# EAGLE board DE0EC8A (EAGLE 5.10), part 1 of 2
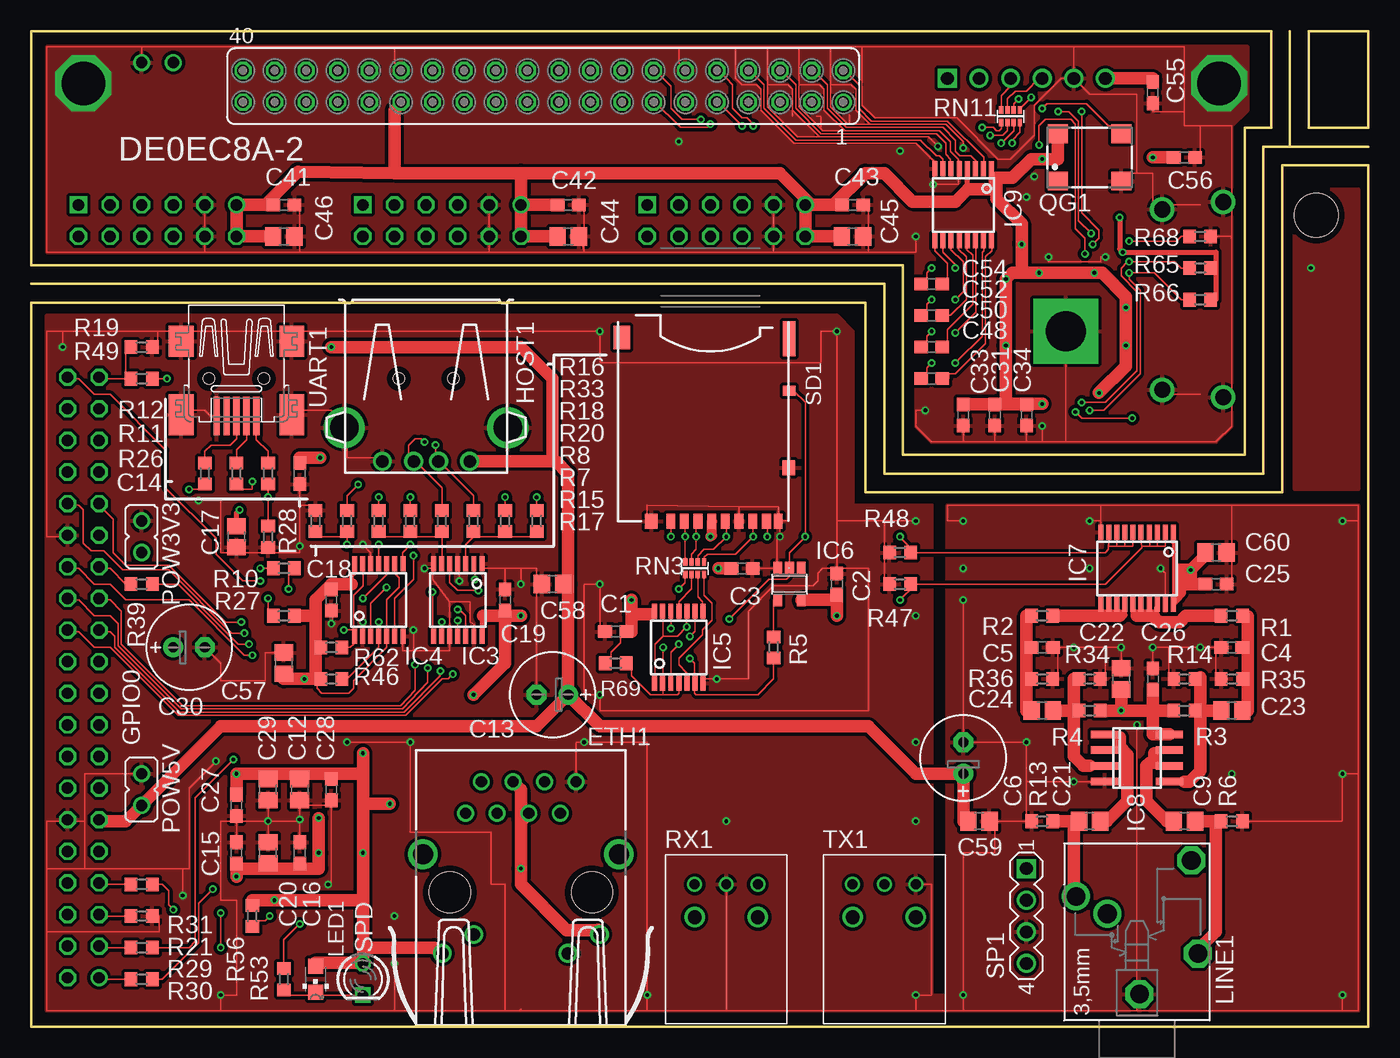
[diagram p2: board, top side]
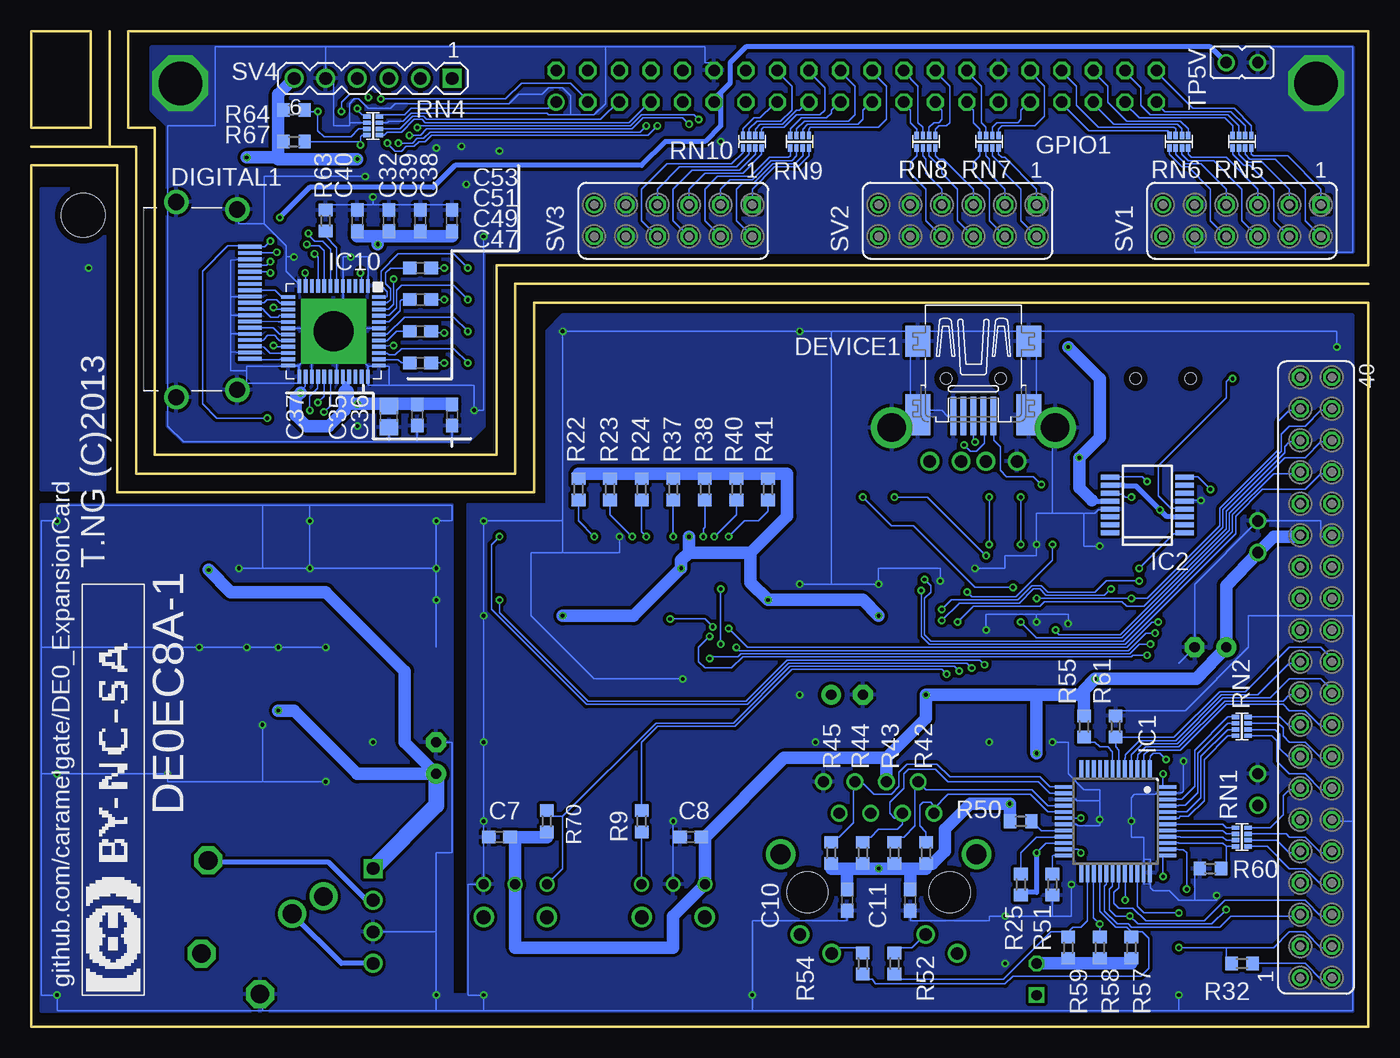
[diagram p3: board, bottom side, seen from below]

Size 107.5 x 80 mm. Coordinates in mm from the lower left corner, seen from the top.
Outline: 0,59.69 68.58,59.69 68.58,44.45 99.06,44.45 99.06,70.72 101.2,70.72
Outline: 101.2,70.72 101.2,80
Outline: 107.5,70.72 101.2,70.72
Outline: 0,0 107.5,0 107.5,69.22 100.56,69.22 100.56,42.95 67.08,42.95 67.08,58.19 0,58.19 0,0
Outline: 0,80 0,61.19 70.08,61.19 70.08,45.95 97.56,45.95 97.56,72.22 99.7,72.22 99.7,80 0,80
Outline: 107.5,80 102.7,80 102.7,72.22 107.5,72.22 107.5,80
Copper layers (1*16): Top 0.035mm / dielectric 1.53mm / Bottom 0.035mm
Design rules "pban_5mil-l2": minimum track width 5mil, minimum drill 0.3mm, track to track 5mil, track to pad 0.229mm, pad to pad 5mil, via to via 5mil, smd to smd 5mil, copper to edge 0.5mm, drill to drill 0.5mm, minimum pad ring 0.15mm, minimum via ring 0.15mm, stop-mask expansion 4mil, vias tented up to drill 0.35mm, thermal gap 10mil
Holes 3.5 mm at 103.3,65.2

## Footprints (pad centres in the part's own frame; a part is rotated, then mirrored left to right if it is on the bottom)
C1608 = smd 1.1 x 1: 1 -0.85,0; 2 0.85,0
E2,5-7 = drill 0.813 pad 1.6 round: + -1.27,0 | drill 0.813 pad 1.6 octagon: - 1.27,0
C2012 = smd 1.3 x 1.5: 1 -0.85,0; 2 0.85,0
32005-201 = smd 3.1 x 0.5: 1 3,1.6; 2 3,0.8; 3 3,0; 4 3,-0.8; 5 3,-1.6 | smd 2.5 x 2: M1 -3,-4.45; M2 -3,4.45 | smd 3.3 x 2: M3 2.9,4.45; M4 2.9,-4.45 | hole 0.9: 0,2.2; 0,-2.2
HDMI-FCI-A-UPDATE = smd 0.3 x 1.9: 1 4.75,8.5; 2 4.25,8.5; 3 3.75,8.5; 4 3.25,8.5; 5 2.75,8.5; 6 2.25,8.5; 7 1.75,8.5; 8 1.25,8.5; 9 0.75,8.5; 10 0.25,8.5; 11 -0.25,8.5; 12 -0.75,8.5; 13 -1.25,8.5; 14 -1.75,8.5; 15 -2.25,8.5; 16 -2.75,8.5; 17 -3.25,8.5; 18 -3.75,8.5; 19 -4.25,8.5 | drill 1.3 round: 20 -7.85,2.6; 21 7.85,2.6; 22 -7.25,7.5; 23 7.25,7.5
J0B = drill 0.9 pad 1.3 round: 1 -4.445,-1.27; 2 -3.175,1.27; 3 -1.905,-1.27; 4 -0.635,1.27; 5 0.635,-1.27; 6 1.905,1.27; 7 3.175,-1.27; 8 4.445,1.27 | drill 1 pad 1.422 round: 9 -6.325,-12.52; 10 -3.785,-11; 11 3.785,-12.52; 12 6.325,-11 | drill 1.6 pad 2.184 round: M1 -7.875,-4.57; M2 7.875,-4.57 | hole 3.3: 5.715,-7.62; -5.715,-7.62
FE20-2 = drill 0.914 round: 1 -24.13,1.27 | drill 0.914 octagon: 2 -24.13,-1.27; 3 -21.59,1.27; 4 -21.59,-1.27; 5 -19.05,1.27; 6 -19.05,-1.27; 7 -16.51,1.27; 8 -16.51,-1.27; 9 -13.97,1.27; 10 -13.97,-1.27; 11 -11.43,1.27; 12 -11.43,-1.27; 13 -8.89,1.27; 14 -8.89,-1.27; 15 -6.35,1.27; 16 -6.35,-1.27; 17 -3.81,1.27; 18 -3.81,-1.27; 19 -1.27,1.27; 20 -1.27,-1.27; 21 1.27,1.27; 22 1.27,-1.27; 23 3.81,1.27; 24 3.81,-1.27; 25 6.35,1.27; 26 6.35,-1.27; 27 8.89,1.27; 28 8.89,-1.27; 29 11.43,1.27; 30 11.43,-1.27; 31 13.97,1.27; 32 13.97,-1.27; 33 16.51,1.27; 34 16.51,-1.27; 35 19.05,1.27; 36 19.05,-1.27; 37 21.59,1.27; 38 21.59,-1.27; 39 24.13,1.27; 40 24.13,-1.27
USB-A = drill 1 round: 1 -3.5,12.99; 2 -1,12.99; 3 1,12.99; 4 3.5,12.99 | drill 2.3 round: P$1 -6.57,10.28; P$2 6.57,10.28
LQFP48 = smd 1.5 x 0.3: 1 -4.15,2.75; 2 -4.15,2.25; 3 -4.15,1.75; 4 -4.15,1.25; 5 -4.15,0.75; 6 -4.15,0.25; 7 -4.15,-0.25; 8 -4.15,-0.75; 9 -4.15,-1.25; 10 -4.15,-1.75; 11 -4.15,-2.25; 12 -4.15,-2.75; 25 4.15,-2.75; 26 4.15,-2.25; 27 4.15,-1.75; 28 4.15,-1.25; 29 4.15,-0.75; 30 4.15,-0.25; 31 4.15,0.25; 32 4.15,0.75; 33 4.15,1.25; 34 4.15,1.75; 35 4.15,2.25; 36 4.15,2.75 | smd 0.3 x 1.5: 13 -2.75,-4.15; 14 -2.25,-4.15; 15 -1.75,-4.15; 16 -1.25,-4.15; 17 -0.75,-4.15; 18 -0.25,-4.15; 19 0.25,-4.15; 20 0.75,-4.15; 21 1.25,-4.15; 22 1.75,-4.15; 23 2.25,-4.15; 24 2.75,-4.15; 37 2.75,4.15; 38 2.25,4.15; 39 1.75,4.15; 40 1.25,4.15; 41 0.75,4.15; 42 0.25,4.15; 43 -0.25,4.15; 44 -0.75,4.15; 45 -1.25,4.15; 46 -1.75,4.15; 47 -2.25,4.15; 48 -2.75,4.15
FT230X = smd 0.4 x 1.5: 1 -2.223,-2.99; 2 -1.587,-2.99; 3 -0.953,-2.99; 4 -0.318,-2.99; 5 0.318,-2.99; 6 0.953,-2.99; 7 1.587,-2.99; 8 2.223,-2.99; 9 2.223,2.99; 10 1.587,2.99; 11 0.953,2.99; 12 0.318,2.99; 13 -0.318,2.99; 14 -0.953,2.99; 15 -1.587,2.99; 16 -2.223,2.99
PW_R-PDSO-G14 = smd 0.4 x 1.2: 1 -1.95,-2.9; 2 -1.3,-2.9; 3 -0.65,-2.9; 4 0,-2.9; 5 0.65,-2.9; 6 1.3,-2.9; 7 1.95,-2.9; 8 1.95,2.9; 9 1.3,2.9; 10 0.65,2.9; 11 0,2.9; 12 -0.65,2.9; 13 -1.3,2.9; 14 -1.95,2.9
SOT23-5 = smd 0.69 x 0.99: 1 -0.95,-1.29; 2 0,-1.29; 3 0.95,-1.29; 4 0.95,1.3; 5 -0.95,1.3
PW_R-PDSO-G20 = smd 0.4 x 1.2: 1 -2.925,-2.9; 2 -2.275,-2.9; 3 -1.625,-2.9; 4 -0.975,-2.9; 5 -0.325,-2.9; 6 0.325,-2.9; 7 0.975,-2.9; 8 1.625,-2.9; 9 2.275,-2.9; 10 2.925,-2.9; 11 2.925,2.9; 12 2.275,2.9; 13 1.625,2.9; 14 0.975,2.9; 15 0.325,2.9; 16 -0.325,2.9; 17 -0.975,2.9; 18 -1.625,2.9; 19 -2.275,2.9; 20 -2.925,2.9
SO08 = smd 0.6 x 2.2: 1 -1.905,-2.6; 2 -0.635,-2.6; 3 0.635,-2.6; 4 1.905,-2.6; 5 1.905,2.6; 6 0.635,2.6; 7 -0.635,2.6; 8 -1.905,2.6
PW_R-PDSO-G16 = smd 0.4 x 1.2: 1 -2.275,-2.9; 2 -1.625,-2.9; 3 -0.975,-2.9; 4 -0.325,-2.9; 5 0.325,-2.9; 6 0.975,-2.9; 7 1.625,-2.9; 8 2.275,-2.9; 9 2.275,2.9; 10 1.625,2.9; 11 0.975,2.9; 12 0.325,2.9; 13 -0.325,2.9; 14 -0.975,2.9; 15 -1.625,2.9; 16 -2.275,2.9
QFN48-A3 = smd 1.1 x 0.3: 1 -3.65,2.75; 2 -3.65,2.25; 3 -3.65,1.75; 4 -3.65,1.25; 5 -3.65,0.75; 6 -3.65,0.25; 7 -3.65,-0.25; 8 -3.65,-0.75; 9 -3.65,-1.25; 10 -3.65,-1.75; 11 -3.65,-2.25; 12 -3.65,-2.75; 25 3.65,-2.75; 26 3.65,-2.25; 27 3.65,-1.75; 28 3.65,-1.25; 29 3.65,-0.75; 30 3.65,-0.25; 31 3.65,0.25; 32 3.65,0.75; 33 3.65,1.25; 34 3.65,1.75; 35 3.65,2.25; 36 3.65,2.75 | smd 0.3 x 1.1: 13 -2.75,-3.65; 14 -2.25,-3.65; 15 -1.75,-3.65; 16 -1.25,-3.65; 17 -0.75,-3.65; 18 -0.25,-3.65; 19 0.25,-3.65; 20 0.75,-3.65; 21 1.25,-3.65; 22 1.75,-3.65; 23 2.25,-3.65; 24 2.75,-3.65; 37 2.75,3.65; 38 2.25,3.65; 39 1.75,3.65; 40 1.25,3.65; 41 0.75,3.65; 42 0.25,3.65; 43 -0.25,3.65; 44 -0.75,3.65; 45 -1.25,3.65; 46 -1.75,3.65; 47 -2.25,3.65; 48 -2.75,3.65 | drill 3.2 pad 5.2 square: EXP 0,0
LSR976 = smd 1.2 x 1.2: A 0,-1.05; C 0,1.05
PG203JA = drill 1.499 octagon: 1 -5.004,-0.203; 4 5.74,-4.369; 5 -1.753,-4.902 | drill 1.499 round: 2 2.845,4.902; 3 1.448,2.388
JP1A = drill 0.914 round: 1 0,-1.27; 2 0,1.27
SM77H = smd 1.6 x 1.5: 1 -2.55,-1.9; 2 2.55,-1.9; 3 2.55,1.9; 4 -2.55,1.9
R0603 = smd 1 x 1.1: 1 -0.85,0; 2 0.85,0
EXB28V = smd 0.35 x 0.6: 1 -0.75,-0.5; 2 -0.25,-0.5; 3 0.25,-0.5; 4 0.75,-0.5; 5 0.75,0.5; 6 0.25,0.5; 7 -0.25,0.5; 8 -0.75,0.5
PL_13X/T10 = drill 0.8 round: 1 2.54,0; 2 0,0; 3 -2.54,0 | drill 1.1 round: 4 2.54,2.63; 5 -2.54,2.63
DM3A-SF-PEJ-A = smd 0.7 x 1.2: 1 3.2,16.55; 2 2.1,16.55; 3 1,16.55; 4 -0.1,16.55; 5 -1.2,16.55; 6 -2.3,16.55; 7 -3.4,16.55; 8 -4.5,16.55; CD1 -5.45,16.55 | smd 1 x 0.8: CD2 -6.325,6.05 | smd 1 x 1.2: GND1 4.75,16.55; GND2 -6.3,12.25 | smd 1 x 2.8: GND3 -6.325,1.875 | smd 1.3 x 1.9: GND4 7.125,1.775
MA04-1A = drill 1.016 square: 1 -3.81,0 | drill 1.016 round: 2 -1.27,0; 3 1.27,0; 4 3.81,0
LED3MM = drill 0.813 octagon: A -1.27,0 | drill 0.813 square: K 1.27,0
FE06-2P = drill 0.914 square: 1 6.35,1.27 | drill 0.914 octagon: 2 6.35,-1.27; 3 3.81,1.27; 4 3.81,-1.27; 5 1.27,1.27; 6 1.27,-1.27; 7 -1.27,1.27; 8 -1.27,-1.27; 9 -3.81,1.27; 10 -3.81,-1.27; 12 -6.35,-1.27 | drill 0.914 round: 11 -6.35,1.27
MA06-1A = drill 1.016 square: 1 -6.35,0 | drill 1.016 round: 2 -3.81,0; 3 -1.27,0; 4 1.27,0; 5 3.81,0; 6 6.35,0

## Placement (x,y rotation side)
C1  0.1u  [C1608]  46.99,31.75 0 top
C2  0.1u  [C1608]  64.77,35.56 270 top
C3  0.1u  [C1608]  57.15,36.83 180 top
C4  220p  [C1608]  96.52,30.48 180 top
C5  220p  [C1608]  81.28,30.48 0 top
C6  47uF  [E2,5-7]  74.93,21.59 90 top
C7  0.1u  [C1608]  69.85,15.24 0 bottom
C8  0.1u  [C1608]  54.48,15.24 0 bottom
C9  10u  [C2012]  92.71,16.51 0 top
C10  0.1u  [C1608]  41.91,10.16 270 bottom
C11  0.1u  [C1608]  36.83,10.16 270 bottom
C12  10u  [C2012]  21.59,19.05 270 top
C13  47uF  [E2,5-7]  41.91,26.67 180 top
C14  0.1u  [C1608]  21.59,44.45 90 top
C15  0.1u  [C1608]  16.51,13.97 90 top
C16  0.1u  [C1608]  21.59,13.97 90 top
C17  10u  [C2012]  16.51,39.37 90 top
C18  0.1u  [C1608]  24.13,34.29 90 top
C19  0.1u  [C1608]  38.1,34.29 270 top
C20  10u  [C2012]  19.05,13.97 90 top
C21  10u  [C2012]  85.09,16.51 180 top
C22  10u  [C2012]  87.63,27.94 90 top
C23  10u  [C2012]  96.52,25.4 180 top
C24  10u  [C2012]  81.28,25.4 0 top
C25  0.1u  [C1608]  95.25,35.56 180 top
C26  0.1u  [C1608]  90.17,27.94 270 top
C27  0.1u  [C1608]  16.51,17.78 270 top
C28  0.1u  [C1608]  24.13,19.05 270 top
C29  10u  [C2012]  19.05,19.05 270 top
C30  47uF  [E2,5-7]  12.7,30.48 0 top
C31  0.1uF  [C1608]  77.47,49.15 270 top
C32  0.1uF  [C1608]  78.74,64.77 90 bottom
C33  0.1uF  [C1608]  74.93,49.15 270 top
C34  0.1uF  [C1608]  80.01,49.15 270 top
C35  0.1uF  [C1608]  76.45,49.15 270 bottom
C36  0.1uF  [C1608]  73.66,49.15 270 bottom
C37  10u  [C2012]  78.74,49.02 270 bottom
C38  0.1uF  [C1608]  73.66,64.77 90 bottom
C39  0.1uF  [C1608]  76.2,64.77 90 bottom
C40  0.1uF  [C1608]  81.28,64.77 90 bottom
C41  0.1uF  [C1608]  20.32,66.04 180 top
C42  0.1uF  [C1608]  43.18,66.04 180 top
C43  0.1uF  [C1608]  66.04,66.04 180 top
C44  10u  [C2012]  43.18,63.5 180 top
C45  10u  [C2012]  66.04,63.5 180 top
C46  10u  [C2012]  20.32,63.5 180 top
C47  0.1uF  [C1608]  76.2,53.34 180 bottom
C48  0.1uF  [C1608]  72.39,52.07 180 top
C49  0.1uF  [C1608]  76.2,55.88 180 bottom
C50  0.1uF  [C1608]  72.39,54.61 180 top
C51  0.1uF  [C1608]  76.2,58.42 180 bottom
C52  0.1uF  [C1608]  72.39,57.15 180 top
C53  0.1uF  [C1608]  76.2,60.96 180 bottom
C54  0.1uF  [C1608]  72.39,59.69 180 top
C55  0.1uF  [C1608]  90.17,75.06 90 top
C56  0.1uF  [C1608]  92.71,69.85 0 top
C57  10u  [C2012]  20.32,29.21 90 top
C58  10u  [C2012]  41.91,35.56 180 top
C59  10u  [C2012]  76.2,16.51 0 top
C60  10u  [C2012]  95.25,38.1 0 top
DEVICE1  MINI-USB-SCHIELD-32005-201  [32005-201]  31.75,52.07 270 bottom
DIGITAL1  [HDMI-FCI-A-UPDATE]  98.42,58.42 270 bottom
ETH1  J0011D21BNL  [J0B]  39.37,18.41 0 top
GPIO0  [FE20-2]  4.2,28.06 90 bottom
GPIO1  [FE20-2]  41.16,75.56 180 top
HOST1  [USB-A]  31.75,58.42 180 top
IC1  DP83848C  [LQFP48]  20.32,16.51 270 bottom
IC2  FT230X  [FT230X]  17.78,41.91 90 bottom
IC3  74CBTLV3125TSSOP  [PW_R-PDSO-G14]  34.29,34.29 180 top
IC4  74VHC125TSSOP  [PW_R-PDSO-G14]  27.94,34.29 0 top
IC5  74VHC125TSSOP  [PW_R-PDSO-G14]  52.07,30.48 0 top
IC6  74LVC1G04DBV  [SOT23-5]  60.96,35.56 180 top
IC7  74VHCT245TSSOP  [PW_R-PDSO-G20]  88.9,36.83 180 top
IC8  LM358D  [SO08]  88.9,21.59 270 top
IC9  FIN1047  [PW_R-PDSO-G16]  74.93,66.04 180 top
IC10  PTN3360DA3  [QFN48-A3]  83.19,55.88 270 bottom
LED1  LSR976  [LSR976]  22.86,3.81 180 top
LINE1  AJ1780  [PG203JA]  88.9,7.62 90 top
POW3V3  [JP1A]  8.89,39.37 180 top
POW5V  [JP1A]  8.89,19.05 180 top
QG1  27MHz  [SM77H]  85.09,69.85 0 top
R1  2.2k  [R0603]  96.52,33.02 0 top
R2  2.2k  [R0603]  81.28,33.02 180 top
R3  100k  [R0603]  92.71,25.4 180 top
R4  100k  [R0603]  85.09,25.4 0 top
R5  10k  [R0603]  59.69,30.48 270 top
R6  56k  [R0603]  96.52,16.51 0 top
R7  22  [R0603]  35.56,40.64 90 top
R8  22  [R0603]  33.02,40.64 90 top
R9  100  [R0603]  58.42,16.51 270 bottom
R10  100  [R0603]  20.32,36.83 180 top
R11  22  [R0603]  16.51,44.45 90 top
R12  22  [R0603]  13.97,44.45 90 top
R13  56k  [R0603]  81.28,16.51 180 top
R14  100k  [R0603]  92.71,27.94 0 top
R15  1.5k  [R0603]  38.1,40.64 90 top
R16  10k  [R0603]  22.86,40.64 270 top
R17  15k  [R0603]  40.64,40.64 270 top
R18  15k  [R0603]  27.94,40.64 270 top
R19  10k  [R0603]  8.89,54.61 180 top
R20  1.5k  [R0603]  30.48,40.64 90 top
R21  10k  [R0603]  8.89,8.89 180 top
R22  10k  [R0603]  63.5,43.18 90 bottom
R23  10k  [R0603]  60.96,43.18 90 bottom
R24  10k  [R0603]  58.42,43.18 90 bottom
R25  2.2k  [R0603]  27.94,11.43 270 bottom
R26  4.7k(4.87k)  [R0603]  19.05,44.45 90 top
R27  10k  [R0603]  20.32,33.02 180 top
R28  10k  [R0603]  19.05,39.37 90 top
R29  100  [R0603]  8.89,6.35 0 top
R30  100  [R0603]  8.89,3.81 0 top
R31  100  [R0603]  8.89,11.43 0 top
R32  100  [R0603]  10.16,5.08 180 bottom
R33  1.5k  [R0603]  25.4,40.64 90 top
R34  100k  [R0603]  85.09,27.94 180 top
R35  1k  [R0603]  96.52,27.94 180 top
R36  1k  [R0603]  81.28,27.94 180 top
R37  10k  [R0603]  55.88,43.18 90 bottom
R38  10k  [R0603]  53.34,43.18 90 bottom
R39  100  [R0603]  8.89,35.56 0 top
R40  10k  [R0603]  50.8,43.18 90 bottom
R41  10k  [R0603]  48.26,43.18 90 bottom
R42  50  [R0603]  35.56,13.97 270 bottom
R43  50  [R0603]  38.1,13.97 270 bottom
R44  50  [R0603]  40.64,13.97 270 bottom
R45  50  [R0603]  43.18,13.97 270 bottom
R46  10k  [R0603]  24.13,27.94 0 top
R47  10k  [R0603]  69.85,35.56 0 top
R48  10k  [R0603]  69.85,38.1 0 top
R49  100  [R0603]  8.89,52.07 0 top
R50  2.2k  [R0603]  27.94,16.51 180 bottom
R51  4.87k(4.7k)  [R0603]  25.4,11.43 270 bottom
R52  120  [R0603]  38.1,5.08 90 bottom
R53  220  [R0603]  20.32,3.81 270 top
R54  120  [R0603]  40.64,5.08 90 bottom
R55  10k  [R0603]  22.86,24.13 90 bottom
R56  1.5k  [R0603]  17.78,8.89 270 top
R57  2.2k  [R0603]  19.05,6.35 270 bottom
R58  2.2k  [R0603]  21.59,6.35 270 bottom
R59  2.2k  [R0603]  24.13,6.35 270 bottom
R60  10k  [R0603]  12.7,12.7 0 bottom
R61  10k  [R0603]  20.32,24.13 270 bottom
R62  10k  [R0603]  24.13,30.48 0 top
R63  10k  [R0603]  83.82,64.77 270 bottom
R64  10k  [R0603]  86.36,73.66 180 bottom
R65  2.2k  [R0603]  93.98,60.96 0 top
R66  2.2k  [R0603]  93.98,58.42 0 top
R67  10k  [R0603]  86.36,71.12 180 bottom
R68  2.2k  [R0603]  93.98,63.5 180 top
R69  10k  [R0603]  46.99,29.21 180 top
R70  10k  [R0603]  66.04,16.51 270 bottom
RN1  100  [EXB28V]  10.16,15.24 90 bottom
RN2  100  [EXB28V]  10.16,24.13 90 bottom
RN3  100  [EXB28V]  53.34,36.83 0 top
RN4  100  [EXB28V]  80.01,72.39 90 bottom
RN5  100  [EXB28V]  10.16,71.12 180 bottom
RN6  100  [EXB28V]  15.24,71.12 180 bottom
RN7  100  [EXB28V]  30.48,71.12 180 bottom
RN8  100  [EXB28V]  35.56,71.12 180 bottom
RN9  100  [EXB28V]  45.72,71.12 180 bottom
RN10  100  [EXB28V]  49.53,71.12 180 bottom
RN11  100  [EXB28V]  78.74,73.15 0 top
RX1  PLR135T10  [PL_13X/T10]  55.88,11.43 180 top
SD1  USD-SOCKETHIROSE-A  [DM3A-SF-PEJ-A]  54.61,57.15 180 top
SP1  [MA04-1A]  80.01,8.89 270 top
SPD  [LED3MM]  26.67,3.81 270 top
SV1  [FE06-2P]  10.16,64.77 0 bottom
SV2  [FE06-2P]  33.02,64.77 0 bottom
SV3  [FE06-2P]  55.88,64.77 0 bottom
SV4  [MA06-1A]  80.01,76.2 180 bottom
TP5V  [JP1A]  10.16,77.47 270 bottom
TX1  PLT133T10  [PL_13X/T10]  68.58,11.43 180 top
UART1  MINI-USB-SCHIELD-32005-201  [32005-201]  16.51,52.07 270 top

## Tracks (layer width: path | path; a pad name or v marks a point on that pad's centre or on a via)
+3V3  (via drill 0.3)
  Top 0.127: 28.57,30.48 28.59,30.97 IC4.5 28.59,31.48 28.57,31.75 28.57,34.29 29.59,35.31 29.59,36.07 29.21,36.45 29.21,36.96 29.24,37.11 IC4.9 29.21,37.22 29.21,37.72 | 28.57,30.48 28.57,31.11 | 28.57,30.48 25.91,27.81 25.91,27.18 25.53,26.8 23.37,26.8 22.99,27.18 22.99,27.94 22.48,27.94 | R69.2 46.1,29.59 46.1,29.34 46.61,29.34 46.61,30.1 47.37,30.86 47.37,31.5 48.01,31.5 47.62,31.75 47.84,31.62 C1.2
  Top 0.406: IC5.14 50.12,33.32 49.78,33.15 | IC4.14 25.99,36.53 25.78,36.32 25.78,35.56 | IC3.14 36.24,32.94 36.32,33.02
  Top 0.813: v54.61,39.37 54.74,39.48 54.74,40.6 SD1.4
  Top 1.016: v55.24,36.83 C3.2 | 48.26,33.15 49.78,33.15 | v48.26,34.29 48.26,33.15 | 48.26,33.15 48.26,31.75 C1.2 | v64.77,33.02 64.77,34.16 | 64.77,34.16 C2.2 | IC6.5 61.95,34.26 61.98,34.29 64.64,34.29 64.77,34.16 | 22.86,33.02 R27.1 | 22.86,27.94 R46.1 | 22.86,30.48 R62.1 | 38.1,33.02 C19.2 | v35.56,26.67 38.1,29.21 38.1,33.02 | 38.1,33.02 v39.37,33.02 | ETH1.4 39.37,19.05 39.37,16.64 | ETH1.5 39.5,16.64 39.37,16.64 | 39.37,16.64 v39.37,12.7 39.37,11.43 43.05,7.75 45.47,7.75 45.57,7.77 ETH1.12 | 32.97,5.77 ETH1.9 33.05,5.74 33.02,5.71 32.97,5.77 | 26.67,6.35 32.38,6.35 32.97,5.77 | 26.67,5.12 26.67,6.35 | 26.67,6.35 26.67,10.16 | R56.1 17.78,10.16 v19.56,10.16 26.67,10.16 | 24.13,35.56 C18.2 | 24.13,35.56 25.78,35.56 | 38.1,33.02 36.32,33.02 | 26.67,17.91 26.67,20.32 | 26.67,17.91 v26.67,13.97 26.67,10.16 | 26.67,17.91 v28.83,17.91 | 26.67,20.32 v26.67,21.97 | 26.67,20.32 24,20.32 | 24,20.32 21.72,20.32 | 21.72,20.32 19.05,20.32 | 19.05,20.32 v16.51,20.32 C27.1 | 24.13,35.56 22.86,34.29 22.86,33.02 | 24,20.32 C28.1 | 21.72,20.32 C12.1 | 19.05,20.32 C29.1 | 22.86,30.48 22.86,33.02 | 22.86,27.94 22.48,27.94 v21.97,27.94 20.32,27.94 C57.1 | 22.86,27.94 22.86,30.48 | LED1.A 22.86,5.12 26.67,5.12 | SPD.A 26.67,5.12
  Bottom 0.127: IC1.22 24.74,14.76 24.77,14.73 25.91,14.73 v26.67,13.97 | IC1.32 19.57,11.82 19.56,11.81 v19.56,10.16 | IC1.48 16.47,19.26 16.51,19.3 v16.51,20.32
  Bottom 0.406: v26.67,13.97 26.67,10.79 27.94,10.79 R25.2
  Bottom 1.016: GPIO0.29 5.46,39.37 7.62,39.37 POW3V3.2 11.43,35.43 C30.+ 13.84,27.94 v21.97,27.94 22.86,27.05 22.86,26.67 | 54.61,38.23 54.61,38.1 55.24,37.47 v55.24,36.83 59.05,33.02 v64.77,33.02 | 54.61,38.23 v54.61,39.37 | R22.2 63.5,44.45 60.96,44.45 | 48.26,44.45 46.74,44.45 46.74,41.02 49.66,38.1 | 48.26,44.45 50.67,44.45 | 50.67,44.45 53.34,44.45 | 53.34,44.45 55.75,44.45 | 55.75,44.45 58.55,44.45 | 58.55,44.45 60.96,44.45 | 49.66,38.1 54.48,38.1 54.61,38.23 | 48.26,44.45 R41.2 | R40.2 50.8,44.32 50.67,44.45 | 53.34,44.45 R38.2 | R37.2 55.88,44.32 55.75,44.45 | R24.2 58.42,44.32 58.55,44.45 | 60.96,44.45 R23.2 | 49.66,38.1 49.66,35.69 v48.26,34.29 40.64,34.29 v39.37,33.02 | 26.67,26.67 v35.56,26.67 35.56,24.77 38.73,21.59 | 53.34,15.24 C8.2 | 53.34,15.24 RX1.1 55.88,8.89 55.88,6.35 68.58,6.35 TX1.2 68.58,15.24 C7.2 66.04,15.24 R70.2 | 53.34,15.24 46.99,21.59 38.73,21.59 | R45.2 43.18,13.08 43.05,12.95 43.05,12.7 | 43.05,12.7 43.18,12.7 | 36.58,12.7 35.56,12.7 R42.2 35.05,13.08 34.04,14.1 34.04,15.88 32,17.91 v28.83,17.91 28.83,16.64 R50.2 | 36.58,12.7 38.1,12.7 | 41.91,12.7 43.05,12.7 | C11.1 36.83,12.32 36.58,12.7 | 38.1,12.7 R43.2 | R44.2 40.64,12.95 40.51,12.7 | 41.91,12.7 C10.1 | 40.51,12.7 v39.37,12.7 38.1,12.7 | 40.51,12.7 41.91,12.7 | 38.73,21.59 ETH1.4 | 21.59,5.08 19.05,5.08 R57.2 | 21.59,5.08 R58.2 | 21.59,5.08 24.13,5.08 | 24.13,5.08 R59.2 | 24.13,5.08 SPD.A | 22.86,26.67 R55.2 | 26.67,26.67 22.86,26.67 | v26.67,21.97 26.67,26.67
+5V  (via drill 0.3)
  Top 0.406: 92.33,34.92 92.33,34.41 IC7.20 91.95,34.05 91.95,38.86 91.83,38.98 IC7.1
  Top 1.016: GPIO0.11 5.46,16.5 6.35,16.51 7.62,16.51 POW5V.2 15.24,24.13 40.64,24.13 C13.+ | C13.+ 45.72,24.13 67.31,24.13 71.12,20.32 C6.+ 74.93,16.51 C59.1 | 41.91,45.43 42.2,45.43 43.18,44.45 43.18,35.56 | 41.91,45.43 HOST1.1 | C13.+ 43.18,35.56 | 21.63,45.3 C14.2 21.59,45.72 v23.24,45.72 | v24.13,54.61 39.37,54.61 41.91,52.07 41.91,45.43 | 87.63,27.05 C22.1 v87.63,25.4 | 87.63,27.05 87.69,26.99 87.63,26.67 v87.63,25.4 | 90.17,25.4 C26.2 | IC8.8 90.17,23.5 90.17,25.4 | 90.17,25.4 R3.2 | v87.63,25.4 R4.2 | v87.63,25.4 90.17,25.4 | v87.63,25.4 87.63,27.05 | v93.22,36.7 92.33,36.7 92.33,34.92 | 93.22,35.56 C25.2 | 43.18,35.56 C58.1 | C60.1 94.36,37.85 v93.22,36.7 | v93.22,36.7 93.22,35.56 | 93.22,35.56 92.71,35.56
  Bottom 0.406: IC2.12 21.91,42.23 21.97,42.29 22.23,42.29
  Bottom 1.016: v24.13,54.61 21.59,52.07 21.59,47.37 v23.24,45.72 23.24,43.31 22.23,42.29 | v87.63,25.4 86.36,25.4 81.28,20.32 C6.+ 77.47,22.86 77.47,28.57 83.82,34.92 91.44,34.92 v93.22,36.7
  Bottom 1.27: SP1.1 74.93,17.78 C6.+
ALOUT
  Top 0.406: LINE1.5 93.8,6.17
  Top 1.016: 95.25,16.51 R6.1 | 95.25,16.51 C9.2 | 95.25,16.51 95.25,7.62 93.8,6.17
AROUT
  Top 0.406: LINE1.2 84,10.11 83.82,10.29
  Top 1.016: 83.82,16.51 R13.1 | 83.82,16.51 C21.2 | 83.82,10.29 83.82,16.51
CD  (via drill 0.3)
  Top 0.127: SD1.CD2 61.09,51.2 61.34,51.05 62.23,50.16 v62.23,39.37 60.96,38.1 IC6.2 60.96,36.2 60.71,35.94 59.31,35.94 v56.13,32.77 | 50.8,31.37 51.94,31.37 v52.7,32.13 52.7,33.37 IC5.10 | 50.8,31.37 50.16,30.73 50.16,27.62 IC5.1 | 50.8,31.37 50.8,33.27 50.77,33.3 IC5.13 50.8,33.41 50.8,33.15
  Bottom 0.127: v62.23,39.37 63.5,40.64 R22.1 | v56.13,32.77 53.34,32.77 v52.7,32.13
CS  (via drill 0.3)
  Top 0.127: SD1.2 52.64,40.58 52.58,40.51 v52.58,39.37 52.58,37.47 52.59,37.71 RN3.8
  Bottom 0.127: v52.58,39.37 50.8,41.15 R40.1
D3V3  (via drill 0.3)
  Top 0.127: 77.6,66.55 77.09,67.58 77.2,67.69
  Top 0.406: IC9.1 77.2,67.69 77.2,67.45 77.34,67.31 | IC9.4 75.25,67.37 75.31,67.31
  Top 1.016: GPIO1.29 29.73,74.18 29.21,73.66 29.21,68.58 | 29.21,68.58 21.46,68.71 18.8,66.04 | 18.8,66.04 SV1.11 SV1.12 C46.2 | 18.8,66.04 C41.2 | 29.21,68.58 39.37,68.58 | 39.37,68.58 SV2.11 | SV2.11 SV2.12 C44.2 | SV2.11 C42.2 | 62.74,66.04 60.2,68.58 39.37,68.58 | C45.2 SV3.12 SV3.11 62.74,66.04 | 62.74,66.04 64.52,66.04 | v85.85,50.93 88.01,53.09 v88.01,54.74 v88.01,57.78 88.01,58.67 86.11,60.58 v85.47,60.58 v81.03,60.58 79.63,60.58 | 64.52,66.04 C43.2 | 64.52,66.04 67.06,68.58 68.58,68.58 70.87,66.29 74.3,66.29 75.31,67.31 77.6,67.31 | 77.6,67.31 77.6,66.55 79.63,64.52 v79.63,62.87 | QG1.4 82.56,71.12 82.55,71.12 | 77.6,67.31 77.6,68.2 78.87,68.2 80.39,69.72 v81.28,69.72 82.55,69.72 82.55,71.12 | 82.55,71.12 QG1.4 | 80.01,50.04 C34.1 78.87,50.04 | 79.88,50 C33.1 | 79.88,50 80.14,50 | 78.36,50.04 77.47,50.04 C31.1 | C55.2 90.17,76.2 SV4.6 | v79.63,62.87 79.63,62.99 | 79.63,62.99 | 78.36,50.04 v78.36,54.74 v78.36,60.07 78.87,60.58 79.63,60.58 | 78.36,50.04 78.87,50.04 | 78.87,50.04 79.88,50.04 | 80.01,50.04 v81.28,50.04 | v79.63,62.87 79.63,62.99 | v79.63,62.87 79.63,60.58 | v90.17,69.85 C56.1 | 79.88,50.04 79.88,50 | 79.88,50.04 80.01,50.04
  Bottom 0.127: IC10.15 87.47,57.63 87.63,57.66 | v88.01,57.78 88.01,57.66 87.63,57.66 | 87.63,57.66 87.38,57.66 | IC10.21 87.88,54.63 87.88,54.74 v88.01,54.74 | IC10.11 85.44,60.29 v85.47,60.58 | 82.42,52.21 82.44,52.21 IC10.32 82.42,52.47 82.42,52.21 | IC10.33 81.94,52.34 82.04,52.32 82.04,51.69 82.3,51.69 82.42,52.21 | v85.85,50.93 86.11,50.96 85.82,51.22 85.47,51.44 85.47,51.94 IC10.26 | IC10.40 79.9,54.63 79.88,54.61 v78.36,54.74 | IC10.46 78.77,57.63 78.36,58.04 v78.36,60.07 | IC10.2 80.94,60.54 v81.03,60.58
  Bottom 0.406: 82.04,50.04 81.79,50.16 | 82.04,51.05 82.04,51.69 | 82.3,51.05 82.3,51.69
  Bottom 1.016: v85.85,50.93 86.23,50.55 86.23,49.15 85.34,48.26 83.57,48.26 82.3,49.53 82.3,51.05 82.04,51.05 82.04,50.04 v81.28,50.04 78.99,50.04 | 76.33,50.04 76.33,50 C35.1 | 78.99,50.04 C37.1 | v81.28,69.72 87.63,69.72 87.63,69.98 | 87.63,70.99 87.63,73.79 | 87.63,73.79 87.63,74.93 SV4.6 | 87.63,73.79 R64.2 | 87.63,70.99 R67.2 | 87.63,69.98 87.76,69.98 | C40.1 81.28,63.5 79.63,63.5 | 78.74,63.5 78.87,63.5 79.63,63.5 | 78.74,63.5 C32.1 | C38.1 73.66,63.5 76.2,63.5 | 76.2,63.5 C39.1 | 78.74,63.5 76.2,63.5 | v79.63,62.87 79.63,63.5 | 87.63,69.98 87.63,70.99 | 87.63,69.98 87.76,69.85 v90.17,69.85 | 78.99,50.04 76.33,50.04 | 76.33,50.04 73.66,50.04 C36.1
D_HPD  (via drill 0.3)
  Top 0.127: v82.55,73.53 83.44,73.53 84.2,72.77 84.2,64.77 v85.22,63.75 | RN11.5 79.49,73.9 79.5,73.9 79.5,73.91 79.63,73.91 v80.39,74.68
  Bottom 0.127: IC10.7 83.44,62.48 84.07,63.12 84.71,63.12 85.22,63.63 v85.22,63.75 | v80.39,74.68 80.64,74.93 81.92,74.93 82.55,74.3 v82.55,73.53
D_SCL  (via drill 0.3)
  Top 0.127: v84.71,62.1 84.71,63.37 83.95,64.14 83.95,72.52 83.57,72.9 81.53,72.9 81.03,72.39 v81.03,70.87
  Bottom 0.127: RN4.8 80.63,71.64 80.77,71.63 80.9,71.63 81.03,71.5 81.03,71.12 | IC10.9 84.44,61.83 v84.71,62.1 84.84,62.23 | v81.03,70.87 81.03,71.12 | 81.03,71.12 R67.1
D_SDA  (via drill 0.3)
  Top 0.127: v84.45,73.53 84.45,65.41 85.85,64.01 85.85,63.37 v85.34,62.87
  Bottom 0.127: RN4.7 81.02,72.14 81.03,72.14 | 81.03,72.14 81.15,72.14 81.79,71.5 83.95,71.5 84.45,72.01 v84.45,73.53 85.34,73.53 85.47,73.66 R64.1 | 81.03,72.14 RN4.7 | IC10.8 83.94,62.34 84.33,62.74 85.22,62.74 v85.34,62.87
DA0  (via drill 0.3)
  Top 0.127: GPIO0.25 5.59,34.29 6.35,34.29 7.24,33.4 7.24,30.73 12.19,25.78 29.72,25.78 30.86,27.05 v30.86,29.08 | 70.99,35.56 86.36,35.56 89.28,38.48 89.28,38.61 | IC7.5 89.22,38.92 89.28,38.61 | IC7.4 89.88,39.03 89.92,38.99 89.92,38.61 | 89.28,38.61 89.92,38.61 | IC7.3 90.53,39.02 90.55,38.99 90.55,38.61 | 89.92,38.61 90.55,38.61 | IC7.2 91.17,38.62 91.19,38.61 90.55,38.61 | 70.99,35.56 R47.2 | 70.99,35.56 70.99,35.43 v69.85,34.29
  Bottom 0.127: 69.85,34.16 v69.85,34.29 69.85,33.27 62.74,26.16 50.04,26.16 46.74,29.46 31.24,29.46 v30.86,29.08
DA1  (via drill 0.3)
  Top 0.127: GPIO0.26 2.93,34.28 3.81,34.29 5.08,33.02 6.35,33.02 6.99,32.38 6.99,30.61 12.06,25.53 29.84,25.53 31.88,27.69 v31.88,28.83 | IC7.9 86.62,38.75 86.61,38.73 86.61,38.61 | 86.61,38.61 86.61,38.35 86.36,38.1 R48.2 71.12,37.68 71.12,37.97 v69.85,39.37 | 87.28,38.63 IC7.8 | 87.28,38.63 87.25,38.61 86.61,38.61 | 87.92,38.65 IC7.7 | 87.92,38.65 87.88,38.61 87.3,38.61 87.28,38.63 | IC7.6 88.58,38.66 88.52,38.61 87.97,38.61 87.92,38.65
  Bottom 0.127: v31.88,28.83 32.26,29.21 46.61,29.21 49.91,25.91 62.87,25.91 70.48,33.53 70.48,38.73 v69.85,39.37
DGND  (via drill 0.3, 3.5)
  Top 0.127: GPIO1.12 52.47,77.07 52.07,77.47 52.07,78.74 | 29.21,78.74 1.27,78.74 1.27,62.23 13.97,62.23 | 29.21,78.74 52.07,78.74 | 13.97,62.23 SV1.10 SV1.9 | GPIO1.30 29.61,77.07 29.21,77.47 29.21,78.74 | C41.1 21.59,66.04 21.59,63.5 | 21.59,63.5 C46.1 | 13.97,62.23 21.59,62.23 | 21.59,62.23 36.83,62.23 | 36.83,62.23 SV2.10 SV2.9 | 44.45,63.5 44.45,63.92 | C44.1 44.03,63.92 44.45,62.23 | 36.83,62.23 44.45,62.23 | 44.45,63.5 C44.1 | 44.45,62.23 44.45,63.5 | 44.45,62.23 59.69,62.23 | 59.69,62.23 SV3.10 SV3.9 | 59.69,62.23 67.31,62.23 | C43.1 67.31,66.04 67.31,63.5 | 67.31,63.5 C45.1 | 67.31,62.23 67.31,63.5 | 67.31,62.23 71.12,62.23 v71.12,63.5 | 96.52,66.04 96.52,72.39 93.98,72.39 | 96.52,66.04 96.52,63.37 | 96.52,63.37 96.52,50.8 | 96.52,50.8 96.52,48.26 95.25,46.99 83.19,46.99 | 92.71,73.53 92.71,78.74 83.82,78.74 | 92.71,73.53 92.71,72.39 93.98,72.39 | 52.07,78.74 56.64,78.74 | 72.52,69.6 71.12,70.99 61.34,70.99 58.67,73.66 58.67,75.31 58.29,75.69 57.15,75.69 56.64,76.2 56.64,78.74 | 72.52,69.6 72.64,69.47 72.64,68.96 IC9.8 | 56.64,78.74 59.18,78.74 | v72.9,70.74 72.14,71.5 63.37,71.5 | 63.37,71.5 61.59,71.5 59.18,73.91 59.18,75.69 | 59.18,78.74 59.18,75.69 | 59.18,78.74 61.72,78.74 | 65.41,72.01 63.75,73.66 63.75,75.31 63.37,75.69 61.72,75.69 | 63.5,72.14 63.5,73.15 63.12,73.15 | 61.72,78.74 61.72,75.69 | 61.72,78.74 64.26,78.74 | v74.93,70.61 74.93,71.12 73.53,72.52 67.44,72.52 | 64.26,75.69 64.26,73.91 65.66,72.52 65.79,72.52 | 64.26,78.74 64.26,75.69 | 64.26,78.74 66.8,78.74 | SV4.5 82.8,76.2 80.64,74.04 80.64,71.63 78.74,69.72 77.72,69.72 74.42,73.03 67.82,73.03 66.8,74.04 66.8,78.74 | 66.8,78.74 83.82,78.74 | C42.1 44.45,66.04 44.45,63.92
  Top 0.127: 44.45,63.92 C44.1 | 21.59,62.23 21.59,63.5 | 83.82,78.74 SV4.5 | QG1.2 87.62,68.57 88.9,68.58 | 88.9,68.58 88.9,74.93 85.09,74.93 SV4.5 | C55.1 90.17,73.53 92.71,73.53 | 93.73,69.72 C56.2 | 93.73,69.72 93.47,69.85 | 93.73,69.72 93.98,69.72 93.98,72.39 | 93.98,66.04 90.3,66.04 90.29,66.03 DIGITAL1.22 90.17,65.91 90.17,68.58 | DIGITAL1.20 95.19,66.23 95.38,66.04 96.52,66.04 | DIGITAL1.21 95.19,50.61 95.38,50.8 96.52,50.8 | DIGITAL1.23 90.67,51.06 90.17,50.8 93.98,50.8 | R68.1 96.39,63.5 96.52,63.37 | 74.93,46.99 C33.2 | 77.47,46.99 C31.2 | 80.01,46.99 C34.2 | 81.28,46.99 v81.28,48.26 | 83.19,46.99 IC10.EXP 82.55,55.88 | 74.93,46.99 72.39,46.99 71.12,48.26 71.12,49.53 v71.88,49.53 | 74.93,46.99 77.47,46.99 | 77.47,46.99 80.01,46.99 | 80.01,46.99 81.28,46.99 | 81.28,46.99 83.19,46.99 | 61.72,75.69 61.72,73.91 63.5,72.14 | 61.21,73.66 61.21,75.31 60.83,75.69 59.18,75.69 | 61.21,73.66 61.21,73.15 | 63.37,71.5 61.21,73.66 | 64.26,75.69 65.91,75.69 66.29,75.31 66.29,73.66 67.44,72.52 | 65.79,72.52 67.44,72.52 | 65.79,72.52 65.79,73.28 | 63.5,72.14 63.63,72.01 65.41,72.01 | 65.41,72.01 73.03,72.01 73.91,71.12 73.91,70.36 74.55,69.72 74.55,69.47 | IC9.5 74.61,69.29 74.55,69.47 | 90.17,68.58 90.17,67.31 | 88.9,68.58 90.17,68.58 | v86.36,61.85 85.98,61.85 85.98,61.47 81.79,61.47 v81.79,61.85 | 74.55,69.47 74.55,67.69 v72.52,67.69 72.52,69.6 | TP5V.2 8.89,78.74
  Bottom 0.127: 78.74,46.99 73.66,46.99 C36.2 | 61.34,78.74 53.34,78.74 53.34,77.47 52.99,77.47 GPIO1.12 | 83.82,78.74 SV4.5 83.19,76.2 83.19,72.39 81.92,72.39 81.92,72.64 | 81.92,72.64 81.92,74.17 81.53,74.55 81.15,74.55 80.39,73.79 78.61,73.79 78.23,74.17 69.09,74.17 68.33,74.93 66.42,74.93 65.91,75.44 64.77,75.44 64.14,74.8 64.14,73.28 | 64.14,73.28 65.91,73.28 66.04,73.41 76.96,73.41 77.6,72.77 78.74,72.77 78.87,72.64 79.38,72.64 RN4.3 | 64.14,73.28 62.23,73.28 61.34,74.17 61.34,78.74 | 61.34,78.74 83.82,78.74 | 83.82,78.74 92.71,78.74 92.71,72.39 96.52,72.39 96.52,48.26 95.25,46.99 78.74,46.99 | 78.74,46.99 C37.2 | 76.45,46.99 C35.2 | 83.19,53.98 83.19,53.72 82.93,53.47 82.93,52.61 | 82.93,52.61 82.93,52.58 | 83.19,53.98 IC10.EXP | 82.93,52.61 IC10.31 | DIGITAL1.2 90.62,54.17 91.44,54.23 | 91.44,54.23 91.44,55.63 | 90.13,55.67 DIGITAL1.5 90.63,55.67 91.44,55.63 | 91.44,55.63 90.13,55.67 | DIGITAL1.8 90.57,57.17 91.44,57.15 | 91.44,55.63 91.44,55.71 | 91.44,55.71 91.44,57.15 | 90.13,55.67 91.44,55.71 | DIGITAL1.11 90.55,58.67 91.44,58.67 | 91.44,57.15 91.44,58.67 | DIGITAL1.17 90.6,61.67 91.44,61.59 91.44,58.67 | IC10.18 85.34,56.13 85.09,55.88 IC10.EXP | IC10.EXP 83.19,58.42 82.55,58.42 82.44,58.43 IC10.5 82.44,59.55 82.42,59.56 82.42,61.85 v81.79,61.85 80.39,61.85 80.39,59.56 80.44,59.52 IC10.1 | IC10.43 81.53,56.13 81.79,55.88 IC10.EXP | IC10.36 80.44,53 80.39,53.09 | 80.39,53.09 81.28,53.98 83.19,53.98 | 80.39,53.09 IC10.37 | 85.94,53.13 IC10.25 | 85.94,53.13 85.09,53.98 84.96,53.98 | 83.19,53.98 84.96,53.98 | 85.94,53.13 IC10.24 | IC10.27 84.94,53.95 84.96,53.98 | 91.44,54.23 91.44,52.7 90.17,52.7
  Bottom 0.127: DIGITAL1.23 90.29,51.31 90.17,51.44 90.17,51.69 | 90.17,52.7 90.17,51.69 | IC10.12 85.94,59.65 87,60.71 87,61.85 | 87,61.85 87,62.74 88.77,64.52 | 87,61.85 v86.36,61.85 | 88.77,64.52 90.81,64.52 90.81,66.04 DIGITAL1.22 | 81.28,66.04 C40.2 | v80.01,66.67 80.01,66.04 78.74,66.04 C32.2 78.7,66.04 | 81.28,66.04 83.82,66.04 R63.1 | C38.2 73.79,66.04 | C38.2 73.66,66.04 | 73.79,66.04 76.2,66.04 | 73.79,66.04 73.7,66.04 C38.2 | 76.2,66.04 C39.2 | 78.7,66.04 81.28,66.04 | 76.2,66.04 78.7,66.04 | 88.77,64.52 88.77,68.33 v80.64,68.33 | 85.94,53.13 85.98,53.09 | 90.17,51.69 85.98,51.69 85.98,53.09 | 85.98,53.09 90.17,53.09 90.17,52.7 | 78.74,51.56 80.39,51.56 80.39,53.09 | 80.39,53.09 78.74,53.09 78.74,51.56 | 78.74,51.56 71.88,51.56 v71.88,49.53 71.12,49.53 v71.12,63.5 | RN4.6 80.64,72.64 81.92,72.64 | 8.89,78.74 1.27,78.74 1.27,62.23 13.97,62.23 SV1.10
  other vias: 4.2,75.8 95.5,75.8 69.85,70.36 52.07,71.12
  pour Top (isolate 0.254): 1.27,78.74 1.27,62.23 71.12,62.23 71.12,48.26 72.39,46.99 95.25,46.99 96.52,48.26 96.52,72.39 97.79,73.66 97.79,78.74
  pour Bottom (isolate 0.254): 1.27,78.74 1.27,62.23 71.12,62.23 71.12,48.26 72.39,46.99 95.25,46.99 96.52,48.26 96.52,72.39 97.79,73.66 97.79,78.74
DI  (via drill 0.3)
  Top 0.127: SD1.3 53.48,40.91 53.47,40.51 v53.47,39.37 53.47,38.35 53.09,37.98 RN3.7
  Bottom 0.127: v53.47,39.37 53.47,40.01 53.34,40.13 R38.1
DM  (via drill 0.3)
  Top 0.127: HOST1.2 32.93,45.43 33.15,45.21 33.15,45.09 35.56,42.67 R7.2 | HOST1.2 32.75,45.58 32.77,45.59 | v32.51,46.74 32.51,45.47 32.62,45.45 HOST1.2
  Bottom 0.127: DEVICE1.2 30.95,47.66 30.86,47.62 30.86,46.86 31.5,46.23 32,46.23 v32.51,46.74
DO  (via drill 0.3)
  Top 0.127: SD1.7 58.01,40.41 58.04,40.26 | 58.04,40.26 58.04,40.51 | 58.04,40.26 v58.04,39.37 56.64,37.97 54.36,37.97 54.09,37.71 RN3.5
  Bottom 0.127: v58.04,39.37 58.42,39.75 R24.1
DP  (via drill 0.3)
  Top 0.127: R8.2 33.02,43.31 30.9,45.43 HOST1.3 30.75,45.61 30.73,45.59 30.35,45.59 30.35,46.74 30.86,47.24 31.37,47.24 v31.62,46.99
  Bottom 0.127: v31.62,46.99 31.75,46.99 DEVICE1.3
DV5V  (via drill 0.3)
  Top 0.406: 95.25,60.96 95.25,62.23 v87.76,62.23 87.5,62.48 v87.5,65.02 | 95.25,60.96 R65.2 | R66.2 95.25,58.42 95.25,60.96
  Bottom 0.127: DIGITAL1.18 87.82,62.17 v87.76,62.23
  Bottom 0.406: 52.07,75.06 52.59,74.56 GPIO1.11 52.58,74.3 52.58,74.17 52.07,73.67 | 52.07,75.06 52.07,73.67 | 52.07,73.67 52.07,72.39 53.34,71.12 56.52,71.12 58.42,69.22 73.41,69.22 75.18,67.44 85.09,67.44 v87.5,65.02 | TP5V.1 12.7,78.74 50.04,78.74 51.31,77.47 51.31,75.82 52.07,75.06
DV_CLK
  Bottom 0.127: GPIO1.1 65.29,74.41 65.91,73.79 76.96,73.79 77.47,73.28 79.39,73.27 RN4.4
DV_CLK27  (via drill 0.3)
  Top 0.127: v81.28,73.79 81.66,74.17 84.84,74.17 86.61,72.39 87.63,72.39 QG1.3
  Bottom 0.127: RN4.5 80.63,73.14 80.77,73.28 80.9,73.28 81.28,73.66 v81.28,73.79
DV_HPD  (via drill 0.3)
  Top 0.127: RN11.4 79.49,71.89 78.87,71.25 v78.87,70.99 | v57.15,72.39 55.13,74.41 GPIO1.9
  Bottom 0.127: v78.87,70.99 78.23,70.36 77.72,70.36 77.34,70.74 76.71,70.74 76.33,71.12 75.82,71.12 75.31,71.63 57.91,71.63 v57.15,72.39
DV_PLL  (via drill 0.3)
  Top 0.127: RN11.6 78.99,74.17 v79.38,74.55
  Bottom 0.127: GPIO1.3 62.75,74.41 62.74,74.42 64.14,75.82 68.07,75.82 69.34,74.55 v79.38,74.55
DV_PLLFB  (via drill 0.3)
  Top 0.127: RN11.3 78.99,72.39 78.99,72.01 v77.98,70.99 | v58.04,72.39 58.17,72.39 57.53,73.03 57.15,73.03 56.39,73.79 56.39,75.69 55.88,76.2 55.13,76.97 GPIO1.10
  Bottom 0.127: v77.98,70.99 76.83,70.99 76.45,71.37 75.95,71.37 75.44,71.88 58.55,71.88 v58.04,72.39
DV_SCL
  Bottom 0.127: GPIO1.7 57.67,74.41 59.44,72.64 75.82,72.64 76.07,72.9 76.71,72.9 77.72,71.88 78.87,71.88 79.11,71.64 RN4.1
DV_SDA
  Bottom 0.127: GPIO1.5 60.21,74.41 61.72,72.9 75.69,72.9 75.95,73.15 76.83,73.15 77.85,72.14 79.12,72.14 RN4.2
DV_TX0
  Top 0.127: GPIO1.2 65.29,76.95 66.55,75.69 66.55,73.79 67.56,72.77 73.66,72.77 76.58,69.85 76.58,69.34 76.56,69.32 IC9.2
DV_TX1
  Top 0.127: GPIO1.4 62.75,76.95 64.01,75.69 64.01,73.79 65.53,72.26 73.28,72.26 74.3,71.25 74.3,70.36 74.68,69.98 75.56,69.98 75.95,69.6 75.95,69.09 75.91,69.05 IC9.3
DV_TX2
  Top 0.127: GPIO1.6 60.21,76.95 61.47,75.69 61.47,73.79 63.5,71.75 72.77,71.75 73.53,70.99 73.53,70.1 73.91,69.72 73.91,69.09 73.95,69.05 IC9.6
DV_TX3
  Top 0.127: GPIO1.8 57.67,76.95 58.93,75.69 58.93,73.79 61.47,71.25 71.5,71.25 72.77,69.98 73.03,69.98 73.28,69.72 73.28,69.22 73.31,69.32 IC9.7
ETH_ACT
  Bottom 0.127: IC1.26 22.57,11.59 22.61,11.56 22.61,8.51 23.11,8 23.75,8 24.13,7.62 | R59.1 24.13,7.62 | 24.13,7.62 25.53,7.62 29.34,3.81 38.1,3.81 R52.1
ETH_CLK  (via drill 0.3)
  Top 0.127: v15.24,6.35 v15.24,9.14
  Bottom 0.127: GPIO0.4 2.8,6.47 2.92,6.35 3.81,6.35 5.08,7.62 6.35,7.62 7.62,6.35 11.43,6.35 | R32.2 11.43,5.08 11.43,6.35 | IC1.34 18.57,9.68 18.03,9.14 v15.24,9.14 | 11.43,6.35 v15.24,6.35
ETH_CLK_OUT
  Bottom 0.127: GPIO0.2 2.8,3.93 2.92,3.81 3.81,3.81 5.08,5.08 R32.1
ETH_COL
  Bottom 0.127: GPIO0.13 5.47,19.04 6.35,19.05 6.86,18.54 6.86,17.02 7.87,16 9.4,16 9.41,15.99 RN1.4
ETH_CRS
  Bottom 0.127: GPIO0.9 5.47,13.96 6.35,13.97 7.37,14.99 9.53,14.99 RN1.2
ETH_LNK
  Bottom 0.127: IC1.28 21.57,11.45 21.59,11.43 21.59,9.27 20.32,8 19.43,8 19.05,7.62 | R54.1 40.64,3.81 39.88,3.81 39.62,3.43 29.21,3.43 28.57,4.06 18.29,4.06 17.65,4.7 17.65,7.11 18.16,7.62 19.05,7.62 | 19.05,7.62 R57.1
ETH_MDC
  Bottom 0.127: GPIO0.6 2.8,8.88 3.81,8.89 5.08,10.16 11.56,10.16 13.21,8.51 17.91,8.51 18.92,9.53 20.07,9.53 20.45,9.91 20.45,10.79 20.07,11.18 20.07,11.43 IC1.31
ETH_MDIO
  Top 0.127: GPIO0.7 5.47,11.42 5.46,11.43 R31.1
ETH_RST_N
  Top 0.127: GPIO0.5 5.59,8.89 R21.2
  Bottom 0.127: GPIO0.5 5.34,9.01 5.46,8.89 11.05,8.89 11.94,8 19.05,8 19.3,8.26 20.19,8.26 21.21,9.27 21.21,11.3 21.08,11.43 21.08,11.68 21.07,11.7 IC1.29
ETH_RXCLK
  Top 0.127: GPIO0.1 5.34,3.93 5.46,3.81 R30.1
ETH_RXD0
  Bottom 0.127: GPIO0.14 2.93,19.04 3.81,19.05 5.08,20.32 6.35,20.32 7.37,21.34 7.37,22.99 7.75,23.37 9.53,23.37 RN2.1
ETH_RXD1
  Bottom 0.127: GPIO0.15 5.34,21.58 6.35,21.59 7.11,22.35 7.11,23.5 7.49,23.88 9.78,23.88 RN2.2
ETH_RXD2
  Bottom 0.127: GPIO0.16 2.93,21.58 3.81,21.59 5.08,22.86 6.35,22.86 6.86,23.37 6.86,24 7.24,24.38 RN2.3 9.53,24.38 RN2.3
ETH_RXD3
  Bottom 0.127: GPIO0.17 5.59,24.13 6.35,24.13 7.11,24.89 9.53,24.89 RN2.4
ETH_RXDV
  Bottom 0.127: GPIO0.8 2.93,11.42 3.81,11.43 5.08,12.7 6.35,12.7 8.13,14.48 9.54,14.49 RN1.1
ETH_RXER
  Bottom 0.127: GPIO0.10 2.93,13.96 3.81,13.97 5.08,15.24 6.35,15.24 6.6,15.49 9.4,15.49 9.39,15.49 RN1.3
ETH_SPD  (via drill 0.3)
  Top 0.127: v21.59,8.26 20.32,6.99 R53.1
  Bottom 0.127: IC1.27 22.07,11.59 22.1,11.56 22.1,8.76 v21.59,8.26 R58.1
ETH_TXCLK
  Top 0.127: GPIO0.3 5.46,6.35 R29.1
ETH_TXD0
  Bottom 0.127: GPIO0.19 5.34,26.79 5.46,26.67 6.35,26.67 6.86,26.16 11.56,26.16 15.24,22.48 17.91,22.48 18.54,21.84 18.54,21.59 18.57,21.56 IC1.3
ETH_TXD1
  Bottom 0.127: GPIO0.20 2.42,26.79 2.54,26.67 3.81,27.94 6.35,27.94 7.87,26.42 11.68,26.42 15.37,22.73 18.16,22.73 19.05,21.84 19.05,21.46 19.07,21.44 IC1.4
ETH_TXD2
  Bottom 0.127: GPIO0.21 5.47,29.2 6.35,29.21 8.89,26.67 11.81,26.67 15.49,22.99 18.41,22.99 19.56,21.84 19.56,21.59 19.57,21.58 IC1.5
ETH_TXD3
  Bottom 0.127: GPIO0.22 3.06,29.2 2.54,29.21 3.81,30.48 6.35,30.48 9.91,26.92 11.94,26.92 15.62,23.24 20.32,23.24 | IC1.6 20.07,21.46 20.07,22.23 20.32,22.48 20.32,23.24 | 20.32,23.24 R61.2
ETH_TXEN
  Bottom 0.127: GPIO0.18 2.93,24.12 3.81,24.13 5.08,25.4 6.35,25.4 6.86,25.91 11.43,25.91 15.11,22.23 17.65,22.23 18.03,21.84 18.03,21.72 18.07,21.63 IC1.2
FB  (via drill 0.3)
  Top 1.016: v16.51,12.06 16.51,12.7 | 16.51,12.7 19.05,12.7 | 16.51,12.7 C15.1 | 19.05,12.7 C20.1 | 19.05,12.7 21.59,12.7 | v23.11,16.76 v23.11,13.97 23.11,12.7 21.59,12.7 | 21.59,12.7 C16.1
  Bottom 0.127: 23.33,14.26 IC1.23 | 23.11,14.22 23.37,14.22 23.33,14.26 | 23.11,14.22 23.33,14.26 | v23.11,13.97 23.11,14.22 | IC1.37 16.47,13.76 16.51,13.72 v16.51,12.06 | IC1.18 23.62,16.76 23.5,16.76 v23.11,16.76
GND  (via drill 0.3)
  Top 0.127: 10.16,55.88 2.54,55.88 | 2.54,55.88 1.27,55.88 1.27,39.37 2.54,39.37 2.66,39.49 GPIO0.30 2.92,39.37 | R19.1 10.16,54.61 10.16,55.88 | 11.43,55.88 12.06,55.25 UART1.M1 12.7,55.71 | 11.43,55.88 10.16,55.88 | UART1.M2 20.96,55.24 20.32,55.88 | 20.32,55.88 12.7,55.88 | 12.7,55.88 12.7,55.71 | 20.32,55.88 v45.72,55.88 45.72,53.34 63.5,53.34 63.5,55.88 v64.77,55.88 64.77,40.64 | 12.7,55.88 11.43,55.88 | v71.12,40.64 68.58,40.64 | 68.58,40.64 64.77,40.64 | 1.27,7.62 1.27,1.27 15.24,1.27 | 1.27,7.62 1.27,12.7 | 2.54,55.88 v2.54,54.61 | 71.12,1.27 v71.12,2.54 72.39,2.54 72.39,11.43 TX1.3 | 15.24,1.27 29.21,1.27 | 29.21,1.27 39.24,1.27 | 39.24,1.27 49.53,1.27 | 49.53,1.27 55.88,1.27 | 55.88,1.27 71.12,1.27 | 15.24,1.27 v15.24,2.54 16.51,2.54 16.51,10.16 15.24,10.16 15.24,16.51 16.51,16.51 | 71.12,1.27 74.93,1.27 | v74.93,34.29 C6.- v80.01,22.86 80.01,16.51 | 74.93,1.27 105.41,1.27 | 105.41,1.27 106.68,1.27 106.68,20.32 | 106.68,20.32 106.68,40.64 | 106.68,40.64 106.68,41.91 96.52,41.91 | 96.52,41.91 85.98,41.91 | 85.98,41.91 73.66,41.91 73.66,40.64 v74.93,40.64 | 106.68,40.64 v105.41,40.64 | 105.41,1.27 v105.41,2.54 | 74.93,1.27 v74.93,2.54 74.93,13.97 77.47,13.97 77.47,16.51 | UART1.M4 12.34,49.17 12.7,49.53 | 12.7,55.71 12.7,49.53 | 20.32,55.88 20.32,49.53 20.68,49.17 UART1.M3 21.23,49.17 21.59,49.53 24.13,49.53 25.18,48.48 HOST1.P$2 25.4,47.92 25.4,45.72 27.94,45.72 28.23,45.43 HOST1.4 | UART1.5 14.43,49.07 13.97,49.53 12.7,49.53 | 85.83,39.88 IC7.10 85.97,39.87 85.98,40.01 85.98,40.64 | 85.98,41.91 85.98,40.64 | 96.52,38.1 96.52,35.56 C25.1 | R35.2 95.25,27.94 95.25,30.48 | 95.25,30.48 95.25,30.73 95.5,30.48 C4.2
  Top 0.127: v93.98,30.48 95.25,30.48 | v93.98,30.48 91.44,30.48 91.44,27.94 R14.1 | 86.36,30.48 v87.63,30.48 C22.2 | v93.98,30.48 v90.17,30.48 C26.1 | 86.36,30.48 v83.82,30.48 82.55,30.48 | 86.36,30.48 86.36,27.94 R34.1 | 82.55,30.48 82.55,27.94 R36.1 | 82.55,30.48 C5.2 | IC7.19 91.17,34.66 91.19,34.67 91.19,36.45 v90.81,36.83 | 106.68,20.32 v105.41,20.32 105.41,16.51 R6.2 | 80.01,16.51 R13.2 80.01,16.93 80.01,19.68 IC8.4 | v88.9,24.26 88.9,1.31 | 60.2,40.64 60.83,40.64 60.83,42.16 SD1.GND2 | SD1.CD1 60.06,40.52 60.07,40.51 60.2,40.64 | v60.2,39.37 60.2,40.64 | SD1.CD1 60.06,40.63 60.07,41.78 56.9,41.78 | SD1.6 56.91,41.01 56.9,41.02 56.9,41.78 | SD1.GND1 49.87,40.6 49.53,40.64 49.53,41.91 56.9,41.78 | v60.2,39.37 59.94,39.12 59.94,37.08 60.01,37.02 IC6.3 59.96,36.85 59.94,36.83 C3.1 | v60.2,39.37 60.2,40.46 SD1.CD1 | 64.77,40.64 64.77,36.83 | 64.77,36.83 C2.1 64.35,36.83 63.63,36.83 63.25,36.45 63.25,35.81 62.87,35.43 59.69,35.43 57.66,33.4 57.66,27.94 v55.12,27.94 53.98,27.94 54.02,27.77 IC5.7 | 55.88,1.27 RX1.2 | R21.1 10.29,8.89 10.29,7.62 1.27,7.62 | 39.24,1.27 39.37,1.4 | 21.59,17.78 v21.59,16.64 21.59,16.51 | v19.05,16.51 19.05,17.78 | IC3.1 36.24,37.17 36.32,37.08 36.32,36.96 36.2,36.83 38.1,36.83 | 38.1,36.83 C19.1 | v31.62,36.83 32.38,36.83 32.26,36.96 32.26,37.21 32.28,37.19 IC3.7 32.26,37.11 32.26,35.94 33.66,34.16 | v26.67,38.73 27.3,38.1 27.3,37.85 27.29,37.96 IC4.12 | IC3.4 34.29,37.59 34.42,37.72 v34.42,35.81 | 39.37,36.83 38.1,36.83 | 19.05,38.1 21.59,38.1 v21.59,38.61 21.59,41.91 | 19.05,38.1 16.51,38.1 | 16.51,38.35 C17.1 16.51,38.1 | 19.05,38.1 R28.1 | R16.1 22.86,41.91 21.59,41.91
  Top 0.127: 24.26,32.38 24.13,32.51 | 24.26,32.38 24.26,33.31 C18.1 | IC3.13 35.59,32.35 35.31,32.51 35.31,34.16 33.66,34.16 | 33.66,34.16 33.66,32 33.53,31.88 33.53,31.5 IC3.10 33.66,31.38 33.66,30.23 30.73,30.23 | v39.37,35.56 39.37,36.83 | 39.37,36.83 40.64,36.83 40.64,35.43 | 40.64,35.43 C13.- | 49.53,1.27 49.53,22.86 43.81,22.86 ETH1.8 | IC4.7 29.87,31.39 29.84,31.37 29.84,30.23 30.73,30.23 | IC4.2 26.64,31.27 26.67,31.24 v26.67,32.51 | 30.73,30.23 v30.73,31.88 | POW5V.1 4.32,20.32 4.32,16.51 | 4.32,12.7 4.32,16.51 | 4.32,16.51 3.81,16.51 2.93,16.5 GPIO0.12 2.53,16.63 2.54,16.51 1.27,16.51 1.27,12.7 | 12.19,12.7 v12.19,10.54 | 1.27,12.7 4.32,12.7 | 4.32,12.7 12.19,12.7 | 16.51,38.1 15.24,38.1 15.24,42.29 v13.46,42.29 | 21.59,41.91 C14.1 | 29.21,1.27 v29.21,5.08 | v24.13,32.38 24.26,32.38 | 64.77,36.83 67.31,36.83 67.31,25.4 45.72,25.4 v45.72,26.67 44.45,26.67 44.45,35.56 v45.72,35.56 45.72,31.75 C1.1 | R47.1 68.58,35.56 68.58,38.1 | 68.58,40.64 68.58,38.1 | 68.58,38.1 R48.1 | 39.5,1.27 38.1,1.27 38.1,11.43 36.96,11.43 36.96,15.62 30.48,15.62 v30.48,22.86 v25.4,22.86 | 16.51,16.51 C15.2 | 16.51,16.51 v19.05,16.51 | 16.51,16.51 C27.2 | v19.05,16.51 C29.2 | v19.05,16.51 21.59,16.51 | 21.59,16.51 C16.2 | v19.05,16.51 C20.2 | 21.59,17.78 C12.2 | C28.2 24.22,18.2 24.13,18.03 24.13,17.78 | C30.- 15.24,29.21 15.24,27.81 18.8,27.81 18.8,30.06 C57.2 | 12.19,12.7 12.7,12.7 12.7,19.18 v14.86,21.34 | 21.59,17.78 24.13,17.78 | 24.13,17.78 24.13,11.43 v23.88,11.43 | 77.47,16.51 C59.2 | 77.47,16.51 80.01,16.51 | 40.64,35.43 C58.2 | 96.52,38.1 C60.2 | 96.52,41.91 96.52,38.1 | 85.98,40.64 v85.09,40.64
  Bottom 0.127: 15.24,1.27 1.27,1.27 1.27,16.51 | GPIO0.12 2.66,16.63 2.54,16.51 1.27,16.51 | 49.53,1.27 71.12,1.27 | DEVICE1.M2 27.3,55.25 26.67,55.88 | v2.54,54.61 2.54,55.88 26.67,55.88 | 26.67,55.88 35.56,55.88 36.2,55.24 DEVICE1.M1 36.2,55.25 36.83,55.88 | 43.18,55.88 36.83,55.88 | 64.77,40.64 v64.77,55.88 43.18,55.88 | 64.77,40.64 v71.12,40.64 v71.12,33.02 71.12,15.24 | 71.12,1.27 v71.12,2.54 72.39,2.54 72.39,11.43 TX1.3 71.12,15.24 | 106.68,20.32 106.68,2.54 v105.41,2.54 105.41,1.27 88.9,1.27 | 106.68,20.32 106.68,30.48 | 74.93,1.27 88.9,1.27 | 74.93,1.27 v74.93,2.54 74.93,7.62 | 71.12,1.27 74.93,1.27 | v74.93,36.83 v85.09,36.83 | v85.09,36.83 88.9,36.83 | v74.93,36.83 v74.93,40.64 73.66,40.64 73.66,41.91 85.09,41.91 | 88.9,41.91 105.41,41.91 v105.41,40.64 | 88.9,41.91 85.09,41.91 | 74.93,7.62 SP1.3 | LINE1.1 88.98,2.62 88.9,2.54 88.9,1.27 | 71.12,15.24 C7.1 | C8.1 55.88,15.11 v55.88,16.51 RX1.2 | 26.67,55.88 26.67,50.8 27.3,50.17 DEVICE1.M3 27.3,48.89 26.67,48.26 25.3,48.26 HOST1.P$2 25.4,47.92 25.4,41.27 | DEVICE1.5 33.83,49.07 34.29,49.53 35.84,49.53 DEVICE1.M4 | DEVICE1.M4 36.2,50.17 36.83,50.8 36.83,55.88 | 38.1,48.26 38.22,48.14 HOST1.P$1 38.2,48.26 36.83,48.26 36.2,48.89 DEVICE1.M4 | v83.82,30.48 v93.98,30.48 106.68,30.48 | 88.9,41.91 88.9,36.83 | v105.41,40.64 105.41,40.26 | v105.41,40.64 106.68,40.64 106.68,30.48 | 88.9,36.83 v90.81,36.83 | 88.9,19.68 96.52,19.68 v96.52,20.32 v105.41,20.32 106.68,20.32 | 88.9,19.68 v88.9,24.26 | 88.9,19.68 v83.82,19.68 | 64.77,40.64 64.77,38.1 | 64.77,38.1 60.2,38.1 v60.2,39.37 | C10.2 41.91,8.51 49.53,8.51 49.53,1.27 | 25.4,8.89 R51.2 | IC1.19 23.63,16.26 23.5,16.26 23.37,16.13 21.59,16.13 v21.59,16.64 21.59,18.16
  Bottom 0.127: IC1.47 17.05,18.76 17.14,18.67 18.8,18.67 19.05,18.41 v19.05,16.51 19.05,15.24 18.03,15.24 18.03,13.46 | 17.57,11.47 IC1.36 17.53,12.95 17.53,13.46 18.03,13.46 | 17.57,11.47 18.03,11.43 18.07,11.47 IC1.35 18.03,13.21 18.03,13.46 | v31.62,36.83 29.21,36.83 29.21,37.85 26.67,37.85 v26.67,38.73 | IC2.13 21.4,41.59 21.46,41.53 21.72,41.53 21.97,41.27 22.86,41.27 | v26.67,38.73 26.67,41.27 25.4,41.27 | v26.67,38.73 26.67,38.61 | 25.4,41.27 22.86,41.27 | 22.86,41.27 22.86,38.61 v21.59,38.61 | 26.67,33.15 30.73,33.15 v30.73,31.88 | 26.67,33.15 v26.67,32.51 | v34.42,35.81 34.42,36.83 39.37,36.83 v39.37,35.56 43.18,35.56 | 43.18,55.88 43.18,35.56 | R61.1 20.32,25.4 14.73,25.4 9.65,30.48 9.65,33.02 1.27,33.02 1.27,16.51 | R60.1 13.97,12.7 13.97,10.16 | 13.97,10.16 15.24,10.16 16,10.92 17.27,10.92 17.53,11.18 17.53,11.43 17.57,11.47 | 13.97,10.16 12.19,10.16 v12.19,10.54 | IC1.15 23.52,18.26 23.5,18.29 23.5,18.16 21.59,18.16 | IC2.5 15.18,42.23 15.24,42.29 v13.46,42.29 | 25.4,8.89 v29.21,8.89 30.48,8.89 30.48,8.51 36.83,8.51 C11.2 | 15.24,1.27 49.53,1.27 | v15.24,2.54 15.24,1.27 | 26.67,33.15 24.13,33.15 v24.13,32.38 | GPIO0.30 2.93,39.36 3.81,39.37 3.81,40.64 POW3V3.1 13.97,35.56 C30.- 15.24,29.21 | 16.55,18.76 15.11,18.8 14.99,18.8 14.86,18.92 v14.86,21.34 | 21.59,18.16 21.59,19.05 22.86,19.05 24.13,20.32 24.13,22.86 v25.4,22.86 | 25.4,8.89 23.88,8.89 v23.88,11.43 | 64.77,38.1 67.31,38.1 67.31,33.02 62.23,27.94 v55.12,27.94 | v74.93,34.29 v74.93,36.83 | 74.93,30.48 74.93,34.16 | 74.93,7.62 74.93,13.97 73.66,13.97 73.66,22.86 C6.- | v85.09,36.83 85.09,41.91 | 43.18,35.56 v45.72,35.56
  other vias: 71.12,22.86 71.12,16.51 44.45,22.86 49.53,2.54
  pour Top (isolate 0.254): 1.27,57.15 64.77,57.15 66.04,55.88 66.04,41.91 72.39,41.91 72.39,2.54 73.66,2.54 73.66,41.91 106.68,41.91 106.68,1.27 1.27,1.27
  pour Bottom (isolate 0.254): 1.27,1.27 1.27,57.15 64.77,57.15 66.04,55.88 66.04,41.91 72.39,41.91 72.39,2.54 73.66,2.54 73.66,41.91 106.68,41.91 106.68,1.27
LED_ACT
  Bottom 0.127: R52.2 38.1,6.35 36.7,6.35 35.56,7.49 | ETH1.10 35.59,7.59 35.56,7.49 | 35.56,7.49 35.69,7.49
LED_LNK
  Bottom 0.127: 43.16,6.33 ETH1.11 | 43.16,6.33 43.18,6.22 43.18,6.35 40.64,6.35 R54.2 | 43.16,6.33 43.18,6.1
LED_SPD
  Top 0.127: R53.2 20.32,2.54 22.73,2.54 | 22.73,2.54 SPD.K | 22.73,2.54 LED1.C
N$1
  Top 0.127: IC9.16 77.2,62.85 77.22,62.48 77.22,62.36 76.71,61.85 76.71,54.86 74.3,52.45 73.79,52.45 73.79,52.07 C48.1 73.53,52.07
N$2
  Bottom 0.127: IC10.38 79.5,53.59 77.98,53.59 77.72,53.34 C47.2
N$3  (via drill 0.3)
  Top 0.127: C48.2 71.75,52.07 72.01,52.32 72.01,52.96 v72.39,53.34
  Bottom 0.127: IC10.39 79.91,54.13 79.88,54.1 78.87,54.1 78.74,53.98 78.23,53.98 77.72,54.48 73.53,54.48 v72.39,53.34
N$4
  Bottom 0.127: IC10.41 80.02,55.13 80.01,55.12 78.87,55.12 78.11,55.88 C49.2
N$5
  Bottom 0.406: SP1.2 80.52,10.16 83.57,13.21 93.22,13.21 93.27,13.26 LINE1.4
N$6
  Top 0.127: UART1.3 16.51,47.24 16,46.74 14.48,46.74 13.97,46.23 R12.2
N$7  (via drill 0.3)
  Top 0.127: R12.1 13.97,43.18 v12.7,43.18
  Bottom 0.127: IC2.8 14.73,44.2 13.72,44.2 v12.7,43.18
N$8  (via drill 0.3)
  Top 0.127: v26.29,43.56 25.4,42.67 R33.2
  Bottom 0.127: DEVICE1.1 30.15,47.93 30.1,47.88 30.1,47.12 29.59,46.61 29.59,44.7 29.08,44.2 26.92,44.2 v26.29,43.56
N$9
  Bottom 0.406: LINE1.3 86.51,9.04 82.55,5.08 SP1.4
N$10  (via drill 0.3)
  Top 0.127: v18.41,36.83 R10.2
  Bottom 0.127: v18.41,36.83 15.62,39.62 14.73,39.62 IC2.1
N$11
  Top 0.406: C24.1 80.01,25.4 | 80.01,33.02 R2.2 | 80.01,27.94 R36.2 | 80.01,30.48 C5.1
  Top 1.016: 80.01,25.4 80.01,27.94 80.01,30.48 80.01,33.02
N$12
  Top 0.406: C23.1 97.79,25.4 | 97.79,27.81 97.66,27.94 R35.1 97.79,27.94 | 97.79,33.02 R1.2 97.79,32.98 | 97.79,30.48 C4.1
  Top 1.016: 97.79,25.4 97.79,27.81 | 97.79,32.98 97.79,30.48 97.79,27.94
N$13
  Top 0.406: 90.27,32.92 90.27,33.02 90.55,33.02 90.42,32.89 90.42,32.91 IC7.18 | 89.88,33.06 IC7.17 | 89.88,33.06 89.92,33.02 | IC7.16 89.22,33.09 88.9,33.02 88.65,33.02 88.58,33.09 IC7.15 | 89.83,33.02 89.88,33.06
  Top 1.016: 90.27,32.92 90.68,32.51 92.33,32.51 92.84,33.02 R1.1 | 89.92,33.02 90.27,33.02 | 88.9,33.02 89.83,33.02
N$14
  Top 0.406: IC7.11 85.97,33.02 85.98,33.02 | IC7.12 86.62,33.03 86.61,33.02 | 87.28,33.05 IC7.13 | 87.5,33.02 87.28,33.05 | IC7.14 87.92,33.06 87.88,33.02 87.5,33.02 | 87.5,33.02 87.3,33.02 87.28,33.05
  Top 1.016: R2.1 85.98,33.02 86.61,33.02 87.5,33.02
N$15
  Top 0.406: IC8.5 92.71,19.68 | 93.98,28.07 R14.2 | 93.98,25.4 R3.1
  Top 1.016: 92.71,19.68 93.09,19.68 93.98,20.57 93.98,25.4 | 93.98,25.4 93.98,28.07 | 93.98,25.4 C23.2
N$16
  Top 0.406: 83.82,27.94 R34.2 | 83.82,25.4 R4.1 | IC8.3 85.09,20.95
  Top 1.016: 83.82,25.4 83.82,27.94 | 83.82,25.4 C24.2 | 85.09,20.95 84.58,20.95 83.82,21.72 83.82,25.4
N$17
  Top 0.127: IC6.4 59.72,34.26 59.69,34.29 R5.1
N$18
  Bottom 0.127: RX1.3 R9.2
N$19  (via drill 0.3)
  Top 0.127: v10.92,52.07 R49.2
  Bottom 0.127: v10.92,52.07 11.18,52.07 11.43,51.82 11.43,50.55 16.89,45.09 16.89,42.67 15.88,41.66 14.85,41.66 IC2.4
N$20  (via drill 0.3)
  Top 0.127: R16.2 22.86,39.37 25.4,39.37 v25.4,38.73 R33.1 | IC3.8 32.34,31.7 32.38,31.62 32.26,31.62 v32.26,34.92
  Bottom 0.127: v32.26,34.92 31.88,34.54 28.32,34.54 25.4,37.47 v25.4,38.73
N$21
  Top 0.406: 90.3,21.97 90.3,22.23 IC8.7 | 90.3,21.21 90.3,20.95 IC8.6
  Top 1.016: 90.3,21.97 90.3,21.21 89.92,21.21 89.66,20.95 89.66,18.16 91.31,16.51 C9.1
N$22
  Top 0.127: UART1.1 18.11,47.17 19.05,46.23 R26.2
N$23
  Top 0.406: 87.5,23.24 87.5,23.5 IC8.1 | 87.5,22.48 87.5,22.23 IC8.2
  Top 1.016: 87.5,23.24 87.5,22.48 88.14,21.84 88.14,18.16 86.49,16.51 C21.1
N$24
  Top 0.127: UART1.2 17.31,47.16 16.51,46.35 R11.2
N$25
  Top 0.127: IC9.13 75.25,62.54 75.18,62.48 75.69,61.98 75.69,58.04 73.66,56.01 73.66,54.74 73.53,54.61 C50.1 | C50.1 73.15,54.61 | C50.1 72.77,54.61
N$26  (via drill 0.3)
  Top 0.127: IC9.11 73.95,62.52 73.91,62.48 74.93,61.47 74.93,59.05 v74.3,58.42